# EAGLE design MiniConnectorBoard (EAGLE 7.6.0)
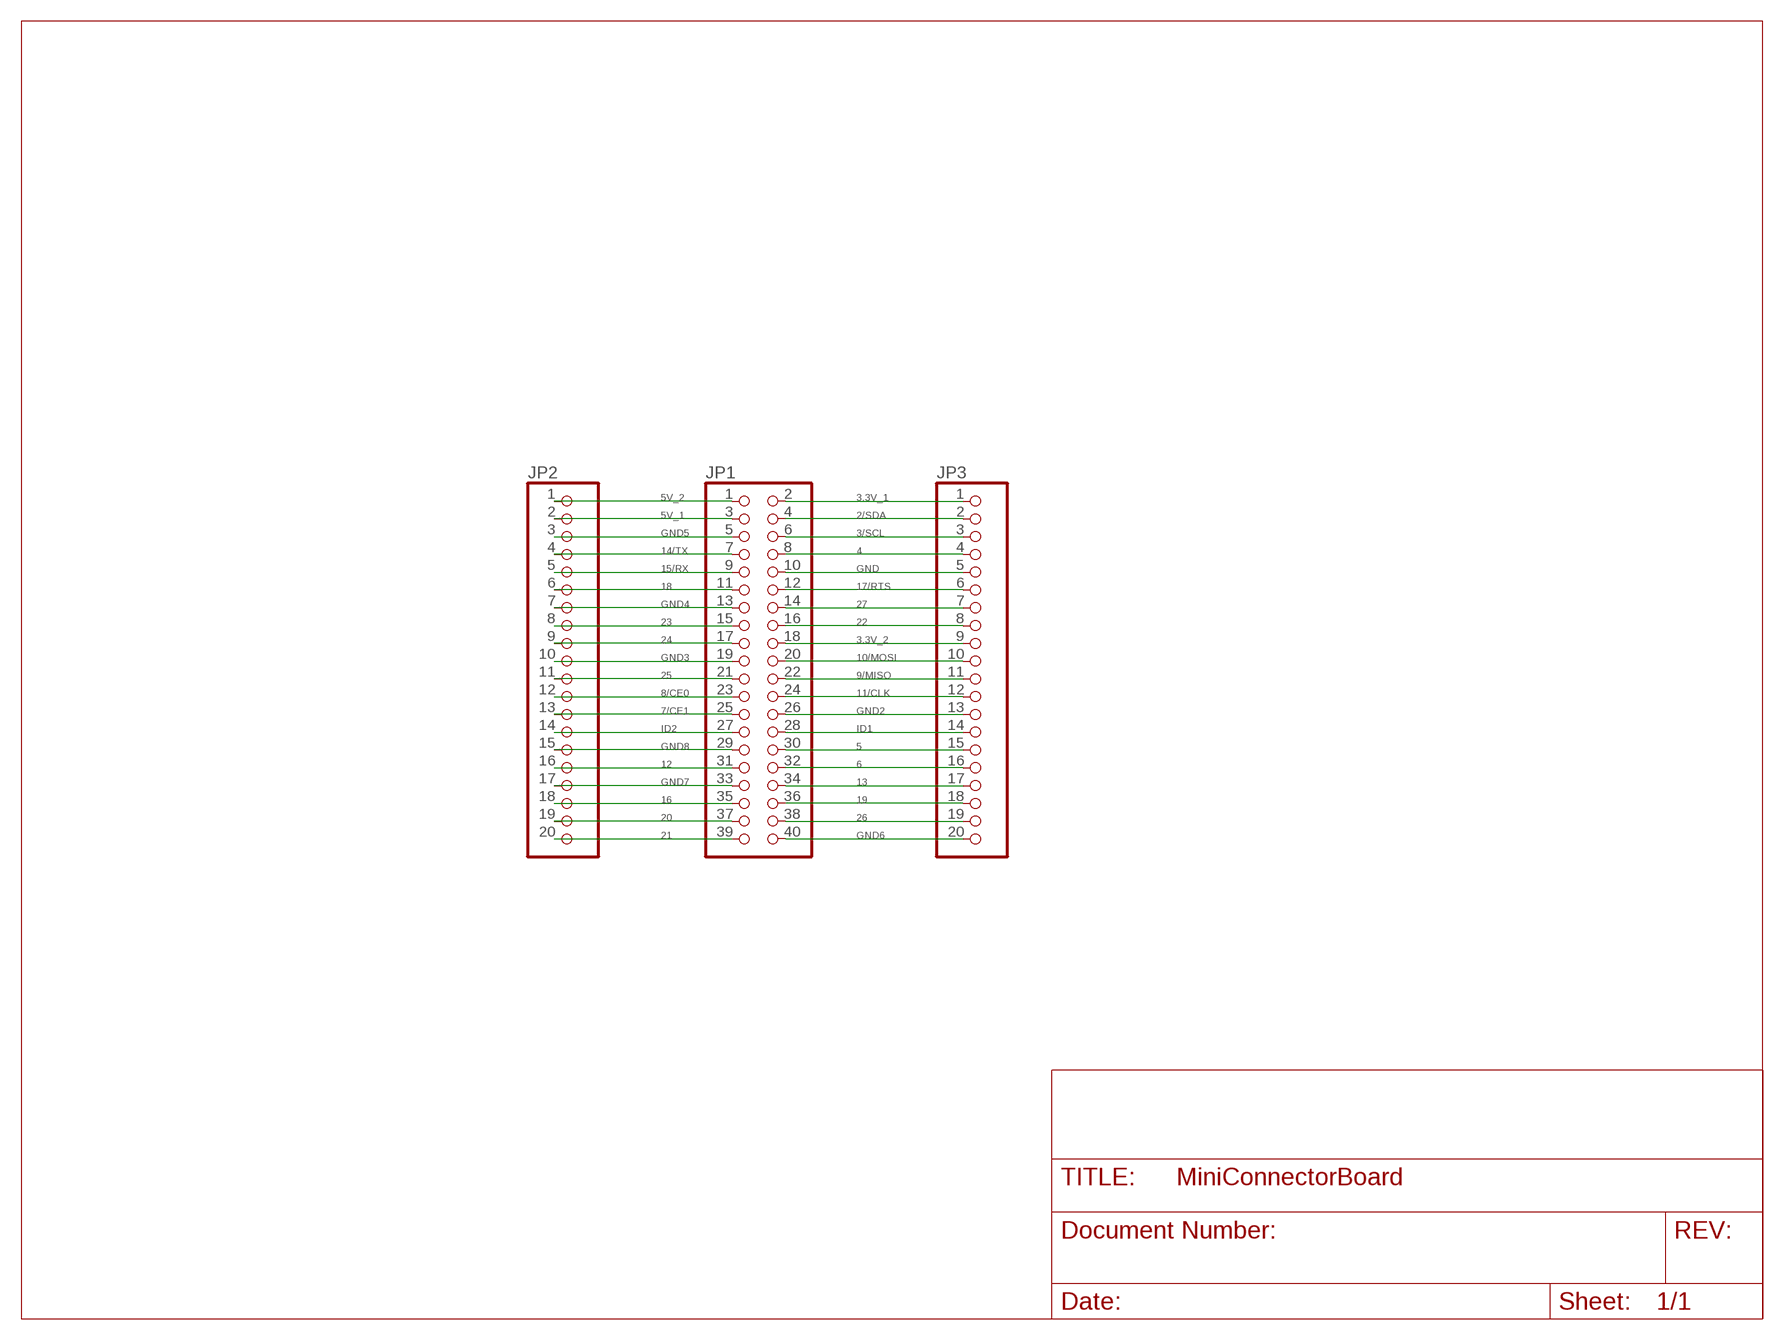
[diagram p0: schematic, sheet 1]

## Parts
JP1  NONE  PINHD-2X20  [2X20]
JP2  NONE  PINHD-1X20  [1X20]
JP3  NONE  PINHD-1X20  [1X20]

## Nets
2/SDA: JP1.4 JP3.2
3.3V_1: JP1.2 JP3.1
3.3V_2: JP1.18 JP3.9
3/SCL: JP1.6 JP3.3
4: JP1.8 JP3.4
5: JP1.30 JP3.15
5V_1: JP1.3 JP2.2
5V_2: JP1.1 JP2.1
6: JP1.32 JP3.16
7/CE1: JP1.25 JP2.13
8/CE0: JP1.23 JP2.12
9/MISO: JP1.22 JP3.11
10/MOSI: JP1.20 JP3.10
11/CLK: JP1.24 JP3.12
12: JP1.31 JP2.16
13: JP1.34 JP3.17
14/TX: JP1.7 JP2.4
15/RX: JP1.9 JP2.5
16: JP1.35 JP2.18
17/RTS: JP1.12 JP3.6
18: JP1.11 JP2.6
19: JP1.36 JP3.18
20: JP1.37 JP2.19
21: JP1.39 JP2.20
22: JP1.16 JP3.8
23: JP1.15 JP2.8
24: JP1.17 JP2.9
25: JP1.21 JP2.11
26: JP1.38 JP3.19
27: JP1.14 JP3.7
GND: JP1.10 JP3.5
GND2: JP1.26 JP3.13
GND3: JP1.19 JP2.10
GND4: JP1.13 JP2.7
GND5: JP1.5 JP2.3
GND6: JP1.40 JP3.20
GND7: JP1.33 JP2.17
GND8: JP1.29 JP2.15
ID1: JP1.28 JP3.14
ID2: JP1.27 JP2.14

## Library data of the parts
JP1 = HeaderConnectorBoard:PINHD-2X20: PIN HEADER
JP2 JP3 = MiniConnectorBoard:PINHD-1X20: PIN HEADER

## Board
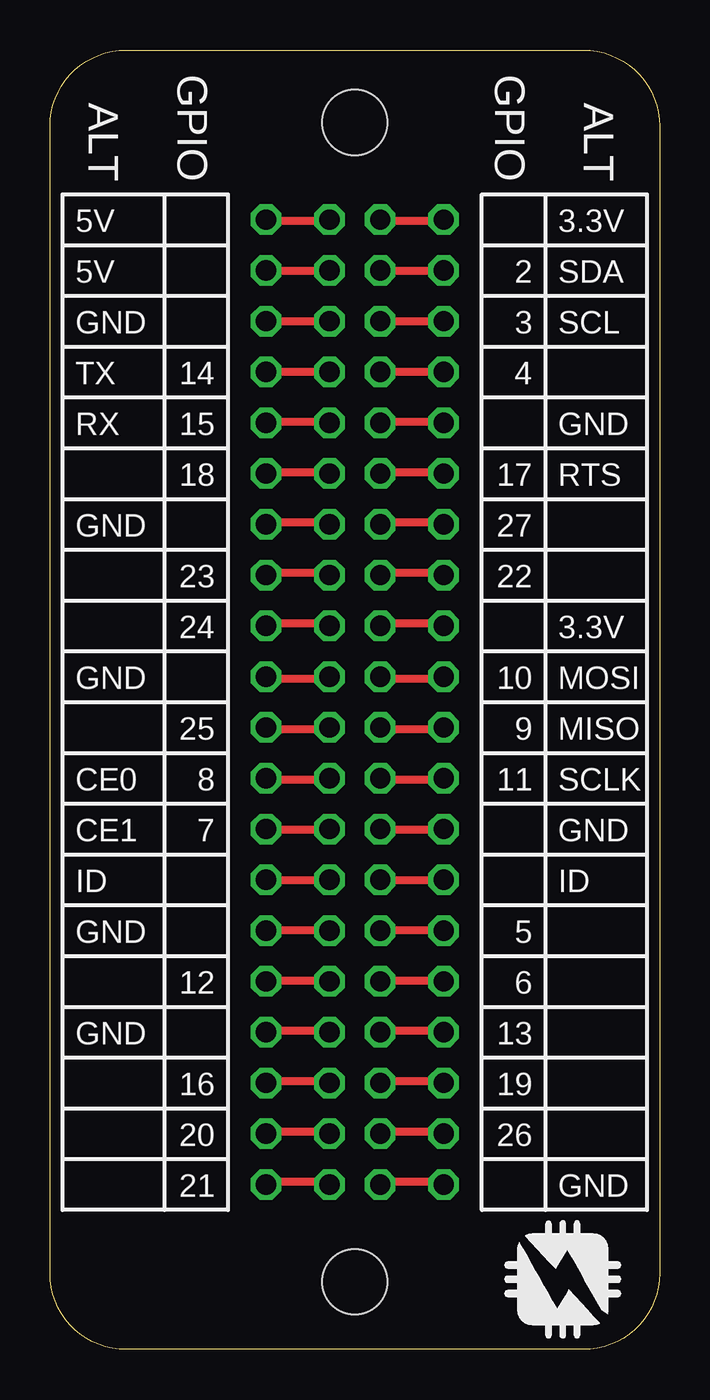
[diagram p1: board, top side]
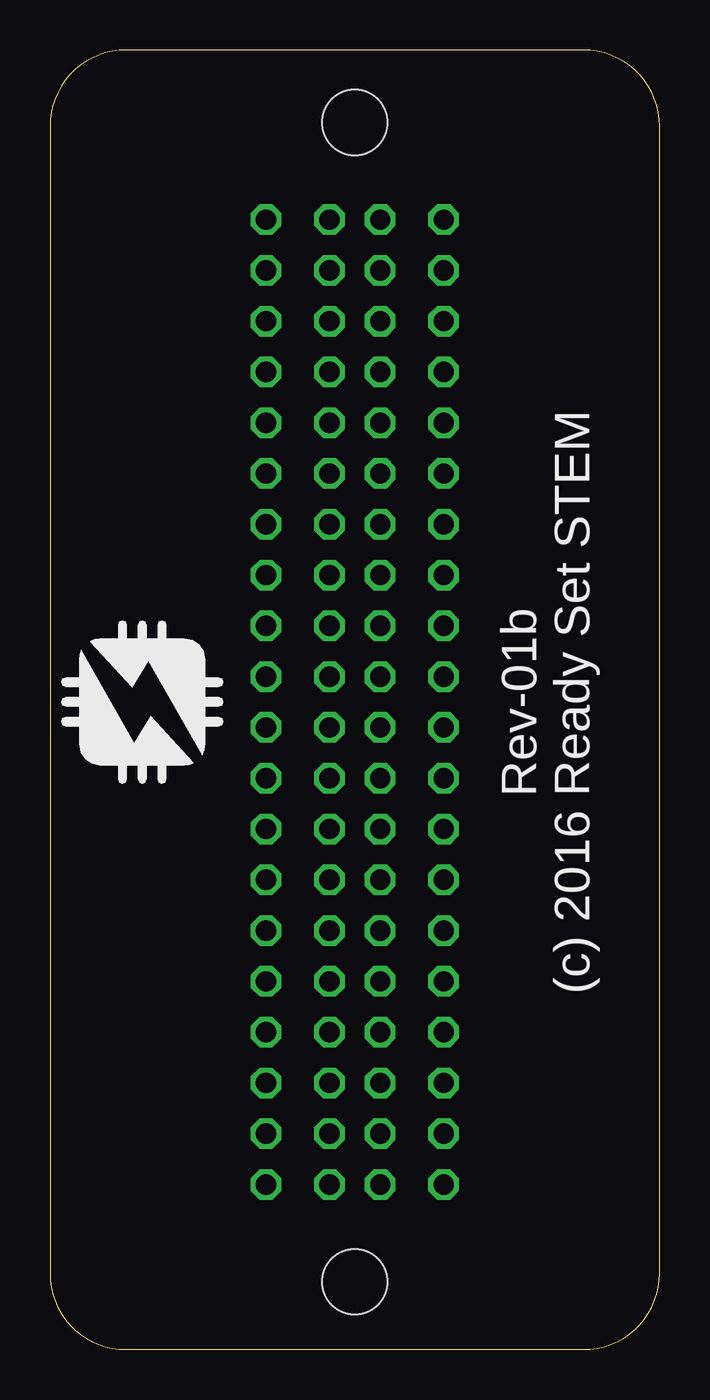
[diagram p2: board, bottom side, seen from below]

Size 30.48 x 65 mm. Coordinates in mm from the lower left corner, seen from the top.
Outline: 30.48,61.18 30.48,3.81 arc-90 26.67,0 3.81,0 arc-90 0,3.81 0,61.18 arc-90 3.82,65 26.66,65 arc-90 30.48,61.18
Copper layers (1*16): Top 0.0356mm / dielectric 1.5011mm / Bottom 0.0356mm
Design rules "LaenPCBOrder *": minimum track width 16mil, minimum drill 13mil, track to track 6mil, track to pad 6mil, pad to pad 6mil, via to via 6mil, smd to smd 6mil, copper to edge 15mil, drill to drill 6mil, minimum pad ring 7mil, minimum via ring 7mil, stop-mask expansion 3mil, vias tented up to drill 0mil, thermal gap 10mil
Holes 3.26 mm at 15.24,3.39 15.24,61.38

### Footprints (pad centres in the part's own frame; a part is rotated, then mirrored left to right if it is on the bottom)
2X20 = drill 1.016 octagon: 1 -24.13,-1.27; 2 -24.13,1.27; 3 -21.59,-1.27; 4 -21.59,1.27; 5 -19.05,-1.27; 6 -19.05,1.27; 7 -16.51,-1.27; 8 -16.51,1.27; 9 -13.97,-1.27; 10 -13.97,1.27; 11 -11.43,-1.27; 12 -11.43,1.27; 13 -8.89,-1.27; 14 -8.89,1.27; 15 -6.35,-1.27; 16 -6.35,1.27; 17 -3.81,-1.27; 18 -3.81,1.27; 19 -1.27,-1.27; 20 -1.27,1.27; 21 1.27,-1.27; 22 1.27,1.27; 23 3.81,-1.27; 24 3.81,1.27; 25 6.35,-1.27; 26 6.35,1.27; 27 8.89,-1.27; 28 8.89,1.27; 29 11.43,-1.27; 30 11.43,1.27; 31 13.97,-1.27; 32 13.97,1.27; 33 16.51,-1.27; 34 16.51,1.27; 35 19.05,-1.27; 36 19.05,1.27; 37 21.59,-1.27; 38 21.59,1.27; 39 24.13,-1.27; 40 24.13,1.27
1X20 = drill 1.016 octagon: 1 -24.13,-1.27; 2 -21.59,-1.27; 3 -19.05,-1.27; 4 -16.51,-1.27; 5 -13.97,-1.27; 6 -11.43,-1.27; 7 -8.89,-1.27; 8 -6.35,-1.27; 9 -3.81,-1.27; 10 -1.27,-1.27; 11 1.27,-1.27; 12 3.81,-1.27; 13 6.35,-1.27; 14 8.89,-1.27; 15 11.43,-1.27; 16 13.97,-1.27; 17 16.51,-1.27; 18 19.05,-1.27; 19 21.59,-1.27; 20 24.13,-1.27

### Placement (x,y rotation side)
JP1  15.24,32.38 270 top
JP2  12.06,32.38 270 top
JP3  20.95,32.38 270 top

### Tracks (layer width: path | path; a pad name or v marks a point on that pad's centre or on a via)
2/SDA
  Top 0.406: JP1.4 16.76,53.92 19.56,53.92 JP3.2
3.3V_1
  Top 0.406: JP1.2 16.76,56.44 19.56,56.44 JP3.1
3.3V_2
  Top 0.406: JP1.18 16.76,36.32 19.56,36.32 JP3.9
3/SCL
  Top 0.406: JP1.6 16.76,51.41 19.56,51.41 JP3.3
4
  Top 0.406: JP3.4 JP1.8
5
  Top 0.406: JP3.15 JP1.30
5V_1
  Top 0.406: JP2.2 10.9,53.92 13.97,53.92 JP1.3
5V_2
  Top 0.406: JP2.1 10.9,56.44 13.97,56.44 JP1.1
6
  Top 0.406: JP1.32 16.76,18.44 19.56,18.44 JP3.16
7/CE1
  Top 0.406: JP2.13 10.9,25.98 13.97,25.98 JP1.25
8/CE0
  Top 0.406: JP2.12 10.9,28.5 13.97,28.5 JP1.23
9/MISO
  Top 0.406: JP1.22 16.76,31.01 19.56,31.01 JP3.11
10/MOSI
  Top 0.406: JP1.20 16.76,33.53 19.56,33.53 JP3.10
11/CLK
  Top 0.406: JP1.24 16.76,28.5 19.56,28.5 JP3.12
12
  Top 0.406: JP2.16 10.9,18.44 13.97,18.44 JP1.31
13
  Top 0.406: JP1.34 16.76,15.93 19.56,15.93 JP3.17
14/TX
  Top 0.406: JP1.7 JP2.4
15/RX
  Top 0.406: JP2.5 10.9,46.38 13.97,46.38 JP1.9
16
  Top 0.406: JP2.18 10.9,13.41 13.97,13.41 JP1.35
17/RTS
  Top 0.406: JP1.12 16.76,43.87 19.56,43.87 JP3.6
18
  Top 0.406: JP2.6 10.9,43.87 13.97,43.87 JP1.11
19
  Top 0.406: JP1.36 16.76,13.41 19.56,13.41 JP3.18
20
  Top 0.406: JP2.19 10.9,10.9 13.97,10.9 JP1.37
21
  Top 0.406: JP2.20 10.9,8.38 13.97,8.38 JP1.39
22
  Top 0.406: JP1.16 16.76,38.84 19.56,38.84 JP3.8
23
  Top 0.406: JP2.8 10.9,38.84 13.97,38.84 JP1.15
24
  Top 0.406: JP2.9 10.9,36.32 13.97,36.32 JP1.17
25
  Top 0.406: JP2.11 10.9,31.01 13.97,31.01 JP1.21
26
  Top 0.406: JP1.38 16.76,10.9 19.56,10.9 JP3.19
27
  Top 0.406: JP1.14 16.76,41.35 19.56,41.35 JP3.7
GND
  Top 0.406: JP1.10 16.76,46.38 19.56,46.38 JP3.5
GND2
  Top 0.406: JP1.26 16.76,25.98 19.56,25.98 JP3.13
GND3
  Top 0.406: JP2.10 10.9,33.53 13.97,33.53 JP1.19
GND4
  Top 0.406: JP2.7 10.9,41.35 13.97,41.35 JP1.13
GND5
  Top 0.406: JP2.3 10.9,51.41 13.97,51.41 JP1.5
GND6
  Top 0.406: JP1.40 16.76,8.38 19.56,8.38 JP3.20
GND7
  Top 0.406: JP2.17 10.9,15.93 13.97,15.93 JP1.33
GND8
  Top 0.406: JP1.29 JP2.15
ID1
  Top 0.406: JP1.28 16.76,23.47 19.56,23.47 JP3.14
ID2
  Top 0.406: JP2.14 10.9,23.47 13.97,23.47 JP1.27

### Text on the board
tPlace: ALT | GPIO | GPIO | ALT | 5V | 3.3V | 5V | 2 | SDA | GND | 3 | SCL | TX | 14 | 4 | RX | 15 | GND | 18 | 17 | RTS | GND | 27 | 23 | 22 | 24 | 3.3V | GND | 10 | MOSI | 25 | 9 | MISO | CE0 | 8 | 11 | SCLK | CE1 | 7 | GND | ID | ID | GND | 5 | 12 | 6 | GND | 13 | 16 | 19 | 20 | 26 | 21 | GND
bPlace: Rev-01b / (c) 2016 Ready Set STEM